# EAGLE design ir (EAGLE 7.1.0)
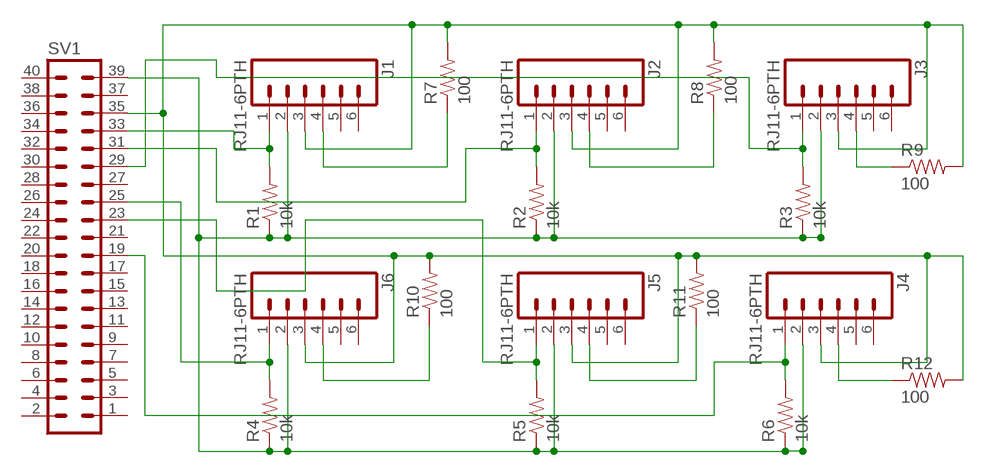
[diagram p0: schematic, sheet 1]

## Parts
J1  RJ11-6PTH  [RJ11-6]
J2  RJ11-6PTH  [RJ11-6]
J3  RJ11-6PTH  [RJ11-6]
J4  RJ11-6PTH  [RJ11-6]
J5  RJ11-6PTH  [RJ11-6]
J6  RJ11-6PTH  [RJ11-6]
R1  10k  10KOHM-1/4W-1%(PTH)HORIZ  [AXIAL-0.3]
R2  10k  10KOHM-1/4W-1%(PTH)HORIZ  [AXIAL-0.3]
R3  10k  10KOHM-1/4W-1%(PTH)HORIZ  [AXIAL-0.3]
R4  10k  10KOHM-1/4W-1%(PTH)HORIZ  [AXIAL-0.3]
R5  10k  10KOHM-1/4W-1%(PTH)HORIZ  [AXIAL-0.3]
R6  10k  10KOHM-1/4W-1%(PTH)HORIZ  [AXIAL-0.3]
R7  100  100OHM1/4W5%(PTH)  [AXIAL-0.3]
R8  100  100OHM1/4W5%(PTH)  [AXIAL-0.3]
R9  100  100OHM1/4W5%(PTH)  [AXIAL-0.3]
R10  100  100OHM1/4W5%(PTH)  [AXIAL-0.3]
R11  100  100OHM1/4W5%(PTH)  [AXIAL-0.3]
R12  100  100OHM1/4W5%(PTH)  [AXIAL-0.3]
SV1  MA20-2  [MA20-2]

## Nets
N$1: J1.2 J2.2 J3.2 J4.2 J5.2 J6.2 R1.P$1 R2.P$1 R3.P$1 R4.P$1 R5.P$1 R6.P$1 SV1.39
N$4: J2.1 R2.P$2 SV1.31
N$5: J3.1 R3.P$2 SV1.29
N$6: J6.1 R4.P$2 SV1.25
N$7: J5.1 R5.P$2 SV1.23
N$8: J4.1 R6.P$2 SV1.19
N$9: J1.1 R1.P$2 SV1.33
N$10: J1.3 J2.3 J3.3 J4.3 J5.3 J6.3 R7.P$2 R8.P$2 R9.P$2 R10.P$2 R11.P$2 R12.P$2 SV1.35
N$12: J1.4 R7.P$1
N$14: J2.4 R8.P$1
N$16: J3.4 R9.P$1
N$18: J6.4 R10.P$1
N$20: J5.4 R11.P$1
N$22: J4.4 R12.P$1
Unconnected: J1.5 J1.6 J2.5 J2.6 J3.5 J3.6 J4.5 J4.6 J5.5 J5.6 J6.5 J6.6 SV1.1 SV1.2 SV1.3 SV1.4 SV1.5 SV1.6 SV1.7 SV1.8 SV1.9 SV1.10 SV1.11 SV1.12 SV1.13 SV1.14 SV1.15 SV1.16 SV1.17 SV1.18 SV1.20 SV1.21 SV1.22 SV1.24 SV1.26 SV1.27 SV1.28 SV1.30 SV1.32 SV1.34 SV1.36 SV1.37 SV1.38 SV1.40

## Library data of the parts
J1-J6 = SparkFun-Connectors:RJ11-6: RJ11 Jack Simple 6 pin RJ11 jack. Commonly found on CAT3 devices and Microchip programmers. SKU: PRT-00132
R1-R6 = SparkFun-Resistors:10KOHM-1/4W-1%(PTH): RES-12183; PROD_ID: RES-12183
R7-R12 = SparkFun-Resistors:100OHM1/4W5%(PTH): RES-08059; PROD_ID: RES-08059
SV1 = con-lstb:MA20-2: PIN HEADER; OC_FARNELL: unknown; OC_NEWARK: unknown

## Net classes
0 default: clearance 0.205 mm

## Board
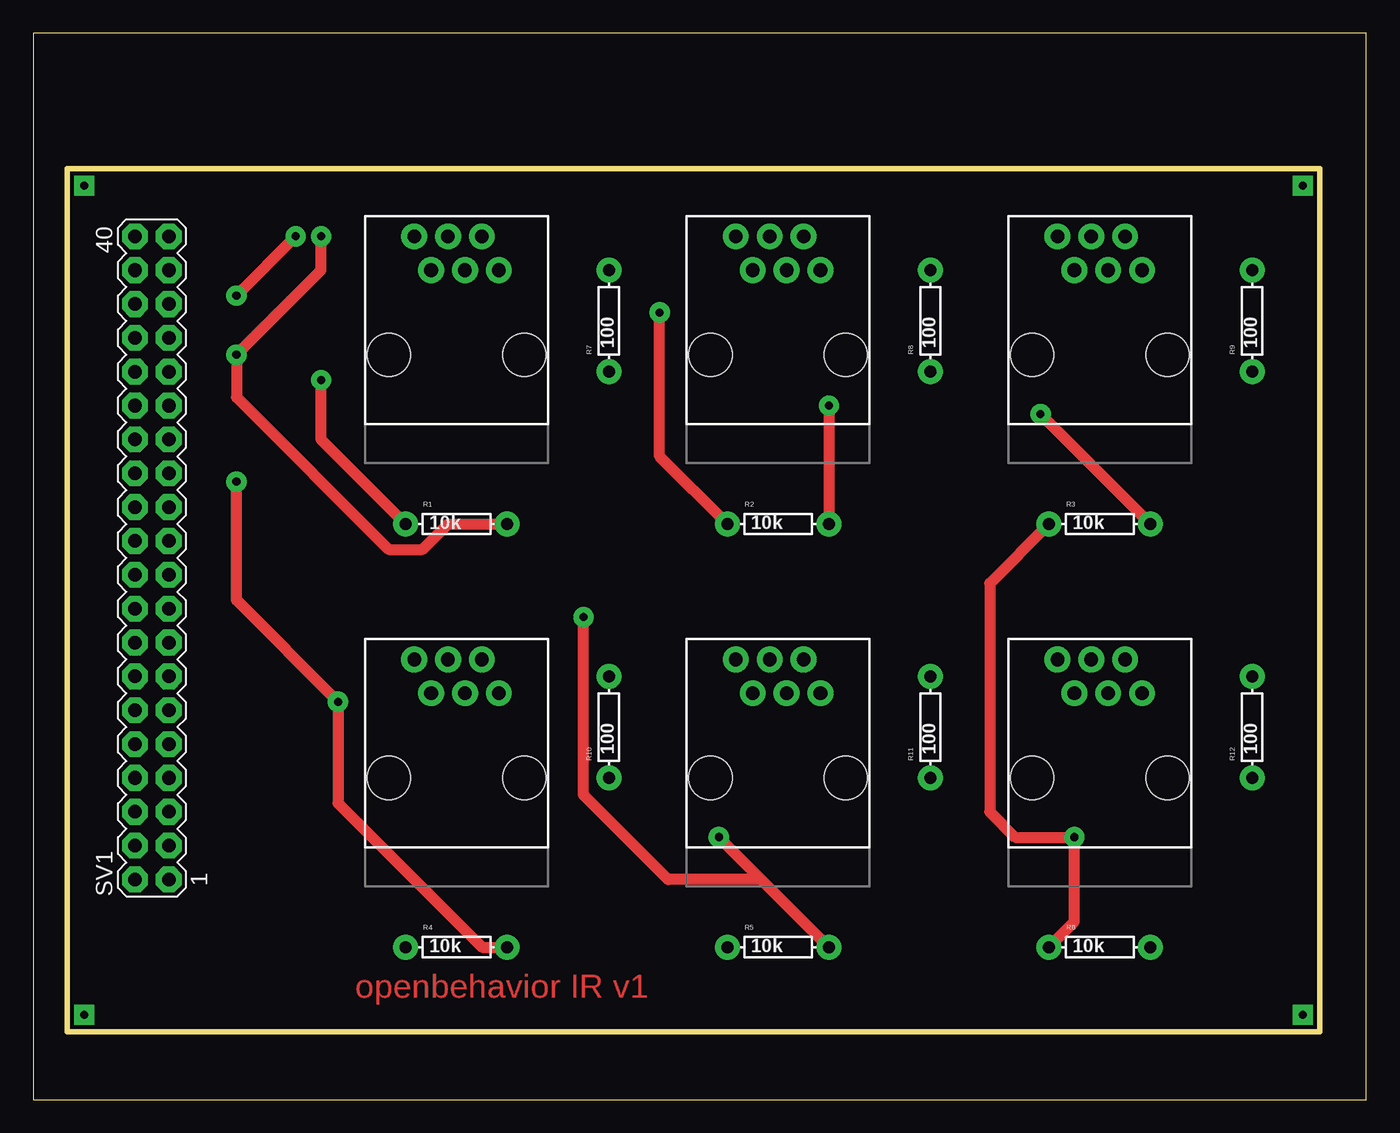
[diagram p1: board, top side]
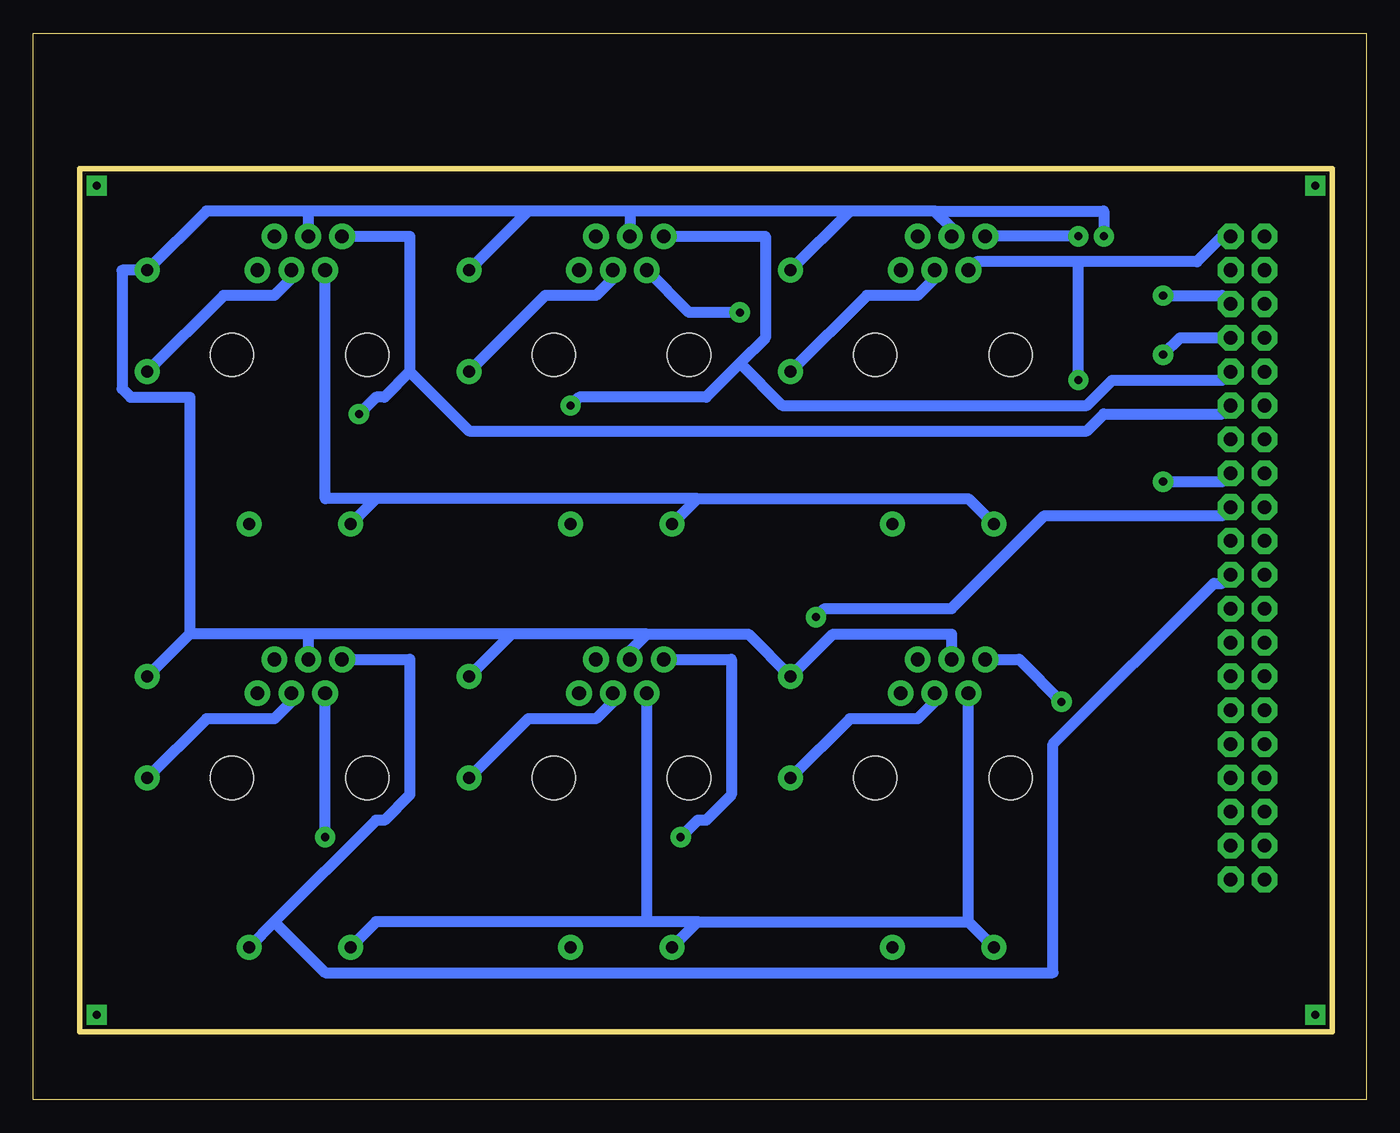
[diagram p2: board, bottom side, seen from below]

Size 100 x 80 mm. Coordinates in mm from the lower left corner, seen from the top.
Outline: 0,0 100,0 100,80 0,80 0,0
Outline: 2.54,69.85 96.52,69.85 96.52,5.08 2.54,5.08 2.54,69.85
Copper layers (1*16): Top 0.035mm / dielectric 1.5mm / Bottom 0.035mm
Design rules "default *": minimum track width 32mil, minimum drill 24mil, track to track 20mil, track to pad 20mil, pad to pad 8mil, via to via 8mil, smd to smd 8mil, copper to edge 40mil, drill to drill 8mil, minimum pad ring 18mil, minimum via ring 18mil, stop-mask expansion 4mil, vias tented up to drill 0mil, thermal gap 10mil
tRestrict: area 5.1,12.7 to 14,67.3; area 48.3,53.3 to 64.8,67.3; area 22.9,53.3 to 40.6,67.3; area 71.1,53.3 to 88.9,67.3; area 24.1,21.6 to 40.6,35.6; area 48.3,21.6 to 64.8,36.8; area 72.4,21.6 to 87.6,36.8

### Footprints (pad centres in the part's own frame; a part is rotated, then mirrored left to right if it is on the bottom)
RJ11-6 = drill 1.016 pad 1.88: 1 1.905,8.89; 2 3.175,6.35; 3 4.445,8.89; 4 5.715,6.35; 5 6.985,8.89; 6 8.255,6.35 | hole 3.251: 0,0; 10.16,0
AXIAL-0.3 = drill 0.9 pad 1.88: P$1 -3.81,0; P$2 3.81,0
MA20-2 = drill 1.016 octagon: 1 -24.13,-1.27; 2 -24.13,1.27; 3 -21.59,-1.27; 4 -21.59,1.27; 5 -19.05,-1.27; 6 -19.05,1.27; 7 -16.51,-1.27; 8 -16.51,1.27; 9 -13.97,-1.27; 10 -13.97,1.27; 11 -11.43,-1.27; 12 -11.43,1.27; 13 -8.89,-1.27; 14 -8.89,1.27; 15 -6.35,-1.27; 16 -6.35,1.27; 17 -3.81,-1.27; 18 -3.81,1.27; 19 -1.27,-1.27; 20 -1.27,1.27; 21 1.27,-1.27; 22 1.27,1.27; 23 3.81,-1.27; 24 3.81,1.27; 25 6.35,-1.27; 26 6.35,1.27; 27 8.89,-1.27; 28 8.89,1.27; 29 11.43,-1.27; 30 11.43,1.27; 31 13.97,-1.27; 32 13.97,1.27; 33 16.51,-1.27; 34 16.51,1.27; 35 19.05,-1.27; 36 19.05,1.27; 37 21.59,-1.27; 38 21.59,1.27; 39 24.13,-1.27; 40 24.13,1.27

### Placement (x,y rotation side)
J1  26.67,55.88 0 top
J2  50.8,55.88 0 top
J3  74.93,55.88 0 top
J4  74.93,24.13 0 top
J5  50.8,24.13 0 top
J6  26.67,24.13 0 top
R1  31.75,43.18 0 top
R2  55.88,43.18 0 top
R3  80.01,43.18 0 top
R4  31.75,11.43 0 top
R5  55.88,11.43 0 top
R6  80.01,11.43 0 top
R7  43.18,58.42 90 top
R8  67.31,58.42 90 top
R9  91.44,58.42 90 top
R10  43.18,27.94 90 top
R11  67.31,27.94 90 top
R12  91.44,27.94 90 top
SV1  8.89,40.64 90 top

### Tracks (layer width: path | path; a pad name or v marks a point on that pad's centre or on a via)
N$1  (via drill 0.61)
  Top 0.813: R6.P$1 78.11,13.34 v78.11,19.68 73.66,19.68 71.75,21.59 71.75,38.73 R3.P$1 | v46.99,59.05 46.99,48.26 R2.P$1 | v21.59,53.98 21.59,49.53 R1.P$1
  Bottom 0.813: 29.84,13.34 R4.P$1 | 50.16,13.34 29.84,13.34 | R5.P$1 50.16,13.34 | R6.P$1 74.3,13.34 53.98,13.34 | 50.16,13.34 53.98,13.34 | 29.84,13.34 J6.2 | 53.98,13.34 J5.2 | v78.11,19.68 J4.2 | J1.2 29.21,62.87 21.59,62.87 | 21.59,62.87 12.7,62.87 10.79,64.77 SV1.39 | R1.P$1 29.84,45.09 50.16,45.09 | R2.P$1 50.16,45.09 | 74.3,45.09 R3.P$1 | 50.16,45.09 74.3,45.09 | J2.2 50.8,59.05 v46.99,59.05 | J3.2 78.11,45.09 74.3,45.09 | v21.59,53.98 21.59,62.87
N$2  (via drill 0.6)
  other vias: 3.81,68.58
N$3  (via drill 0.6)
  other vias: 95.25,68.58
N$4  (via drill 0.61)
  Top 0.813: v59.69,52.07 R2.P$2
  Bottom 0.813: v59.69,52.07 59.05,52.7 49.53,52.7 46.99,55.24 | 46.99,55.24 45.09,57.15 45.09,64.77 J2.1 | SV1.31 10.79,53.98 19.05,53.98 20.95,52.07 43.81,52.07 46.99,55.24
N$5  (via drill 0.61)
  Top 0.813: v75.56,51.44 R3.P$2
  Bottom 0.813: v75.56,51.44 74.3,52.7 73.66,52.7 71.75,54.61 | 71.75,54.61 71.75,64.77 J3.1 | SV1.29 10.79,51.44 19.68,51.44 20.95,50.16 67.31,50.16 71.75,54.61
N$6  (via drill 0.61)
  Top 0.813: R4.P$2 33.66,11.43 22.86,22.23 v22.86,29.84 15.24,37.47 v15.24,46.35
  Bottom 0.813: v22.86,29.84 26.04,33.02 J6.1 | SV1.25 10.79,46.35 v15.24,46.35
N$7  (via drill 0.61)
  Top 0.813: v51.44,19.68 54.61,16.51 | 54.61,16.51 R5.P$2 | v41.27,36.2 41.27,22.86 47.62,16.51 54.61,16.51
  Bottom 0.813: v51.44,19.68 50.16,20.95 49.53,20.95 47.62,22.86 47.62,33.02 J5.1 | SV1.23 10.79,43.81 24.13,43.81 31.11,36.83 40.64,36.83 v41.27,36.2
N$8
  Bottom 0.813: 81.92,13.34 74.3,20.95 73.66,20.95 71.75,22.86 71.75,33.02 J4.1 | 81.92,13.34 R6.P$2 | SV1.19 10.79,38.73 11.43,38.73 23.5,26.67 23.5,9.53 78.11,9.53 81.92,13.34
N$9  (via drill 0.61)
  Top 0.813: R1.P$2 31.11,43.18 29.21,41.27 26.67,41.27 15.24,52.7 v15.24,55.88 21.59,62.23 v21.59,64.77
  Bottom 0.813: v15.24,55.88 13.97,57.15 SV1.33 | v21.59,64.77 J1.1
N$10  (via drill 0.61)
  Top 0.813: v19.68,64.77 v15.24,60.33
  Bottom 0.813: 53.98,34.92 46.35,34.92 R10.P$2 40.01,34.92 31.11,34.92 J6.3 | 53.98,34.92 55.24,33.66 J5.3 | 64.14,34.92 R11.P$2 | 53.98,34.92 64.14,34.92 | 88.27,34.92 R12.P$2 | 64.14,34.92 79.38,34.92 | 79.38,34.92 88.27,34.92 | 79.38,34.92 J4.3 | 38.73,66.67 R7.P$2 | 32.38,66.67 38.73,66.67 | 32.38,66.67 31.11,65.41 J1.3 | 62.87,66.67 R8.P$2 | 38.73,66.67 55.24,66.67 | 55.24,66.67 62.87,66.67 | 62.87,66.67 79.38,66.67 | 79.38,66.67 87,66.67 R9.P$2 93.34,62.23 93.34,53.34 92.71,52.7 88.27,52.7 88.27,34.92 | SV1.35 10.79,60.33 v15.24,60.33 | v19.68,64.77 19.68,66.67 32.38,66.67 | 55.24,66.67 J2.3 | 79.38,66.67 J3.3
N$11  (via drill 0.6)
  other vias: 95.25,6.35
N$12
  Bottom 0.813: R7.P$1 37.47,60.33 33.66,60.33 32.38,61.59 J1.4
N$13  (via drill 0.6)
  other vias: 3.81,6.35
N$14
  Bottom 0.813: R8.P$1 61.59,60.33 57.78,60.33 56.52,61.59 J2.4
N$16
  Bottom 0.813: R9.P$1 85.72,60.33 81.92,60.33 80.64,61.59 J3.4
N$18
  Bottom 0.813: R10.P$1 38.73,28.57 33.66,28.57 32.38,29.84 J6.4
N$20
  Bottom 0.813: R11.P$1 62.87,28.57 57.78,28.57 56.52,29.84 J5.4
N$22
  Bottom 0.813: R12.P$1 87,28.57 81.92,28.57 80.64,29.84 J4.4

### Text on the board
Top: openbehavior IR v1